# EAGLE design bloxa (EAGLE 9.6.2)
Assembly variants: Basic, nocaps
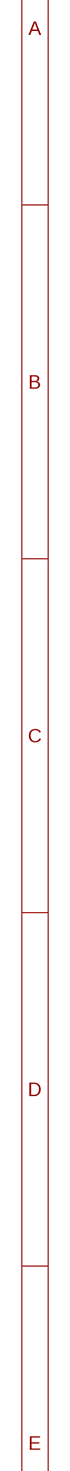
[diagram p0: schematic, sheet 1, part 1 of 2]
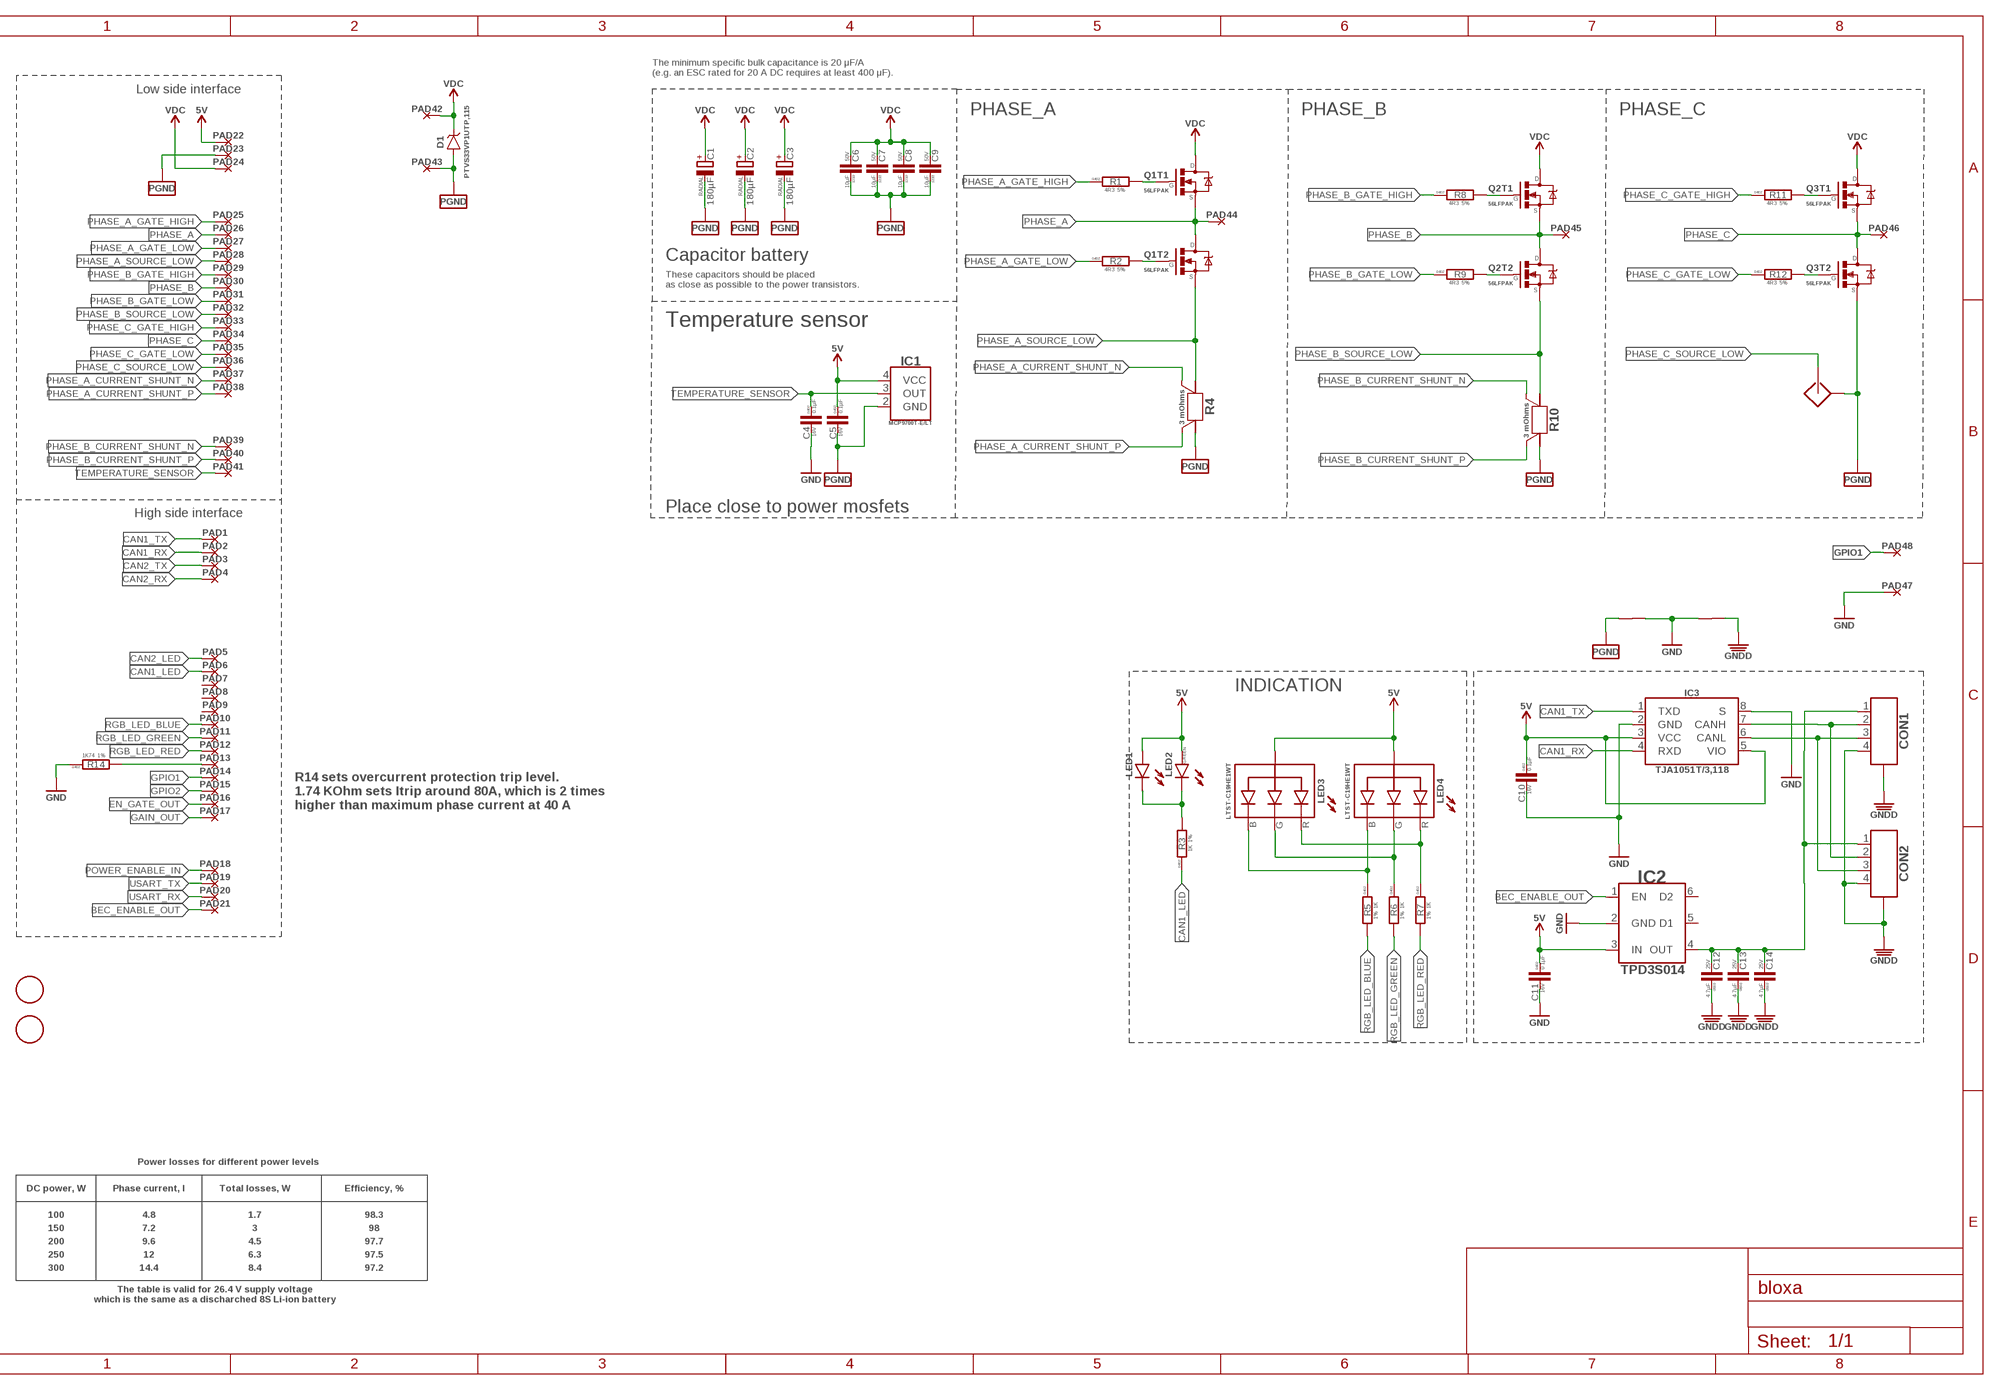
[diagram p1: schematic, sheet 1, part 2 of 2]

## Parts
C1  180µF  CPOL-RADIAL_SIDE-8X21.5  [RADIAL_SIDE_8X21.5]  (not fitted in variant nocaps)
C2  180µF  CPOL-RADIAL_SIDE-8X21.5  [RADIAL_SIDE_8X21.5]  (not fitted in variant nocaps)
C3  180µF  CPOL-RADIAL_SIDE-8X21.5  [RADIAL_SIDE_8X21.5]  (not fitted in variant nocaps)
C4  0.1µF  0.1µF-16V_10%_X7R-0402  [C0402]
C5  0.1µF  0.1µF-16V_10%_X7R-0402  [C0402]
C6  10µF  10µF-50_10%_X7S-C1210  [C1210]
C7  10µF  10µF-50_10%_X7S-C1210  [C1210]
C8  10µF  10µF-50_10%_X7S-C1210  [C1210]
C9  10µF  10µF-50_10%_X7S-C1210  [C1210]
C10  0.1µF  0.1µF-16V_10%_X7R-0402  [C0402]
C11  0.1µF  0.1µF-16V_10%_X7R-0402  [C0402]
C12  4.7µF  4.7µF-25V_10%_X6S-0603  [C0603]
C13  4.7µF  4.7µF-25V_10%_X6S-0603  [C0603]
C14  4.7µF  4.7µF-25V_10%_X6S-0603  [C0603]
CON1  CON-4P-JST_GH-RA  [JST_GH-4P-RA]
CON2  CON-4P-JST_GH-RA  [JST_GH-4P-RA]
D1  PTVS33VP1UTP,115-36V-SOD128  [SOD128]
FD1  FIDUCIALMOUNT  [FIDUCIA-MOUNT]  (not fitted in variant Basic)
FD2  FIDUCIALMOUNT  [FIDUCIA-MOUNT]  (not fitted in variant Basic)
IC1  MCP9700-SC70-5  [SC70-5]
IC2  TPD3S014DBVR-SOT23-6  [SOT26]
IC3  TJA1051(X)/3-SO8  [SOIC8]
J1  CONNECTION  [CONNECTION]  (not fitted in variant Basic)  (not fitted in variant nocaps)
J2  CONNECTION  [CONNECTION]  (not fitted in variant Basic)  (not fitted in variant nocaps)
LED1  GREEN  LED-0402  [LED0402]  (not fitted in variant Basic)
LED2  GREEN  LED-0402  [LED0402]
LED3  LTST-C19HE1WT  [0606]  (not fitted in variant Basic)
LED4  LTST-C19HE1WT  [0606]
PAD1  PAD-1X1.5  [SMD_1X1,5]  (not fitted in variant Basic)
PAD2  PAD-1X1.5  [SMD_1X1,5]  (not fitted in variant Basic)
PAD3  PAD-1X1.5  [SMD_1X1,5]  (not fitted in variant Basic)
PAD4  PAD-1X1.5  [SMD_1X1,5]  (not fitted in variant Basic)
PAD5  PAD-HOLE-0.6  [HOLE_0.6]  (not fitted in variant Basic)
PAD6  PAD-HOLE-0.6  [HOLE_0.6]  (not fitted in variant Basic)
PAD7  PAD-HOLE-0.6  [HOLE_0.6]  (not fitted in variant Basic)
PAD8  PAD-HOLE-0.6  [HOLE_0.6]  (not fitted in variant Basic)
PAD9  PAD-HOLE-0.6  [HOLE_0.6]  (not fitted in variant Basic)
PAD10  PAD-HOLE-0.6  [HOLE_0.6]  (not fitted in variant Basic)
PAD11  PAD-HOLE-0.6  [HOLE_0.6]  (not fitted in variant Basic)
PAD12  PAD-HOLE-0.6  [HOLE_0.6]  (not fitted in variant Basic)
PAD13  PAD-HOLE-0.6  [HOLE_0.6]  (not fitted in variant Basic)
PAD14  PAD-HOLE-0.6  [HOLE_0.6]  (not fitted in variant Basic)
PAD15  PAD-HOLE-0.6  [HOLE_0.6]  (not fitted in variant Basic)
PAD16  PAD-HOLE-0.6  [HOLE_0.6]  (not fitted in variant Basic)
PAD17  PAD-HOLE-0.6  [HOLE_0.6]  (not fitted in variant Basic)
PAD18  PAD-HOLE-0.6  [HOLE_0.6]  (not fitted in variant Basic)
PAD19  PAD-HOLE-0.6  [HOLE_0.6]  (not fitted in variant Basic)
PAD20  PAD-HOLE-0.6  [HOLE_0.6]  (not fitted in variant Basic)
PAD21  PAD-HOLE-0.6  [HOLE_0.6]  (not fitted in variant Basic)
PAD22  PAD-1X1.5  [SMD_1X1,5]  (not fitted in variant Basic)
PAD23  PAD-1X1.5  [SMD_1X1,5]  (not fitted in variant Basic)
PAD24  PAD-1X1.5  [SMD_1X1,5]  (not fitted in variant Basic)
PAD25  PAD-HOLE-0.6  [HOLE_0.6]  (not fitted in variant Basic)
PAD26  PAD-HOLE-0.6  [HOLE_0.6]  (not fitted in variant Basic)
PAD27  PAD-HOLE-0.6  [HOLE_0.6]  (not fitted in variant Basic)
PAD28  PAD-HOLE-0.6  [HOLE_0.6]  (not fitted in variant Basic)
PAD29  PAD-HOLE-0.6  [HOLE_0.6]  (not fitted in variant Basic)
PAD30  PAD-HOLE-0.6  [HOLE_0.6]  (not fitted in variant Basic)
PAD31  PAD-HOLE-0.6  [HOLE_0.6]  (not fitted in variant Basic)
PAD32  PAD-HOLE-0.6  [HOLE_0.6]  (not fitted in variant Basic)
PAD33  PAD-HOLE-0.6  [HOLE_0.6]  (not fitted in variant Basic)
PAD34  PAD-HOLE-0.6  [HOLE_0.6]  (not fitted in variant Basic)
PAD35  PAD-HOLE-0.6  [HOLE_0.6]  (not fitted in variant Basic)
PAD36  PAD-HOLE-0.6  [HOLE_0.6]  (not fitted in variant Basic)
PAD37  PAD-HOLE-0.6  [HOLE_0.6]  (not fitted in variant Basic)
PAD38  PAD-HOLE-0.6  [HOLE_0.6]  (not fitted in variant Basic)
PAD39  PAD-HOLE-0.6  [HOLE_0.6]  (not fitted in variant Basic)
PAD40  PAD-HOLE-0.6  [HOLE_0.6]  (not fitted in variant Basic)
PAD41  PAD-HOLE-0.6  [HOLE_0.6]  (not fitted in variant Basic)
PAD42  PAD-4X2  [4X2]  (not fitted in variant Basic)
PAD43  PAD-4X2  [4X2]  (not fitted in variant Basic)
PAD44  PAD-HOLE_1.5  [HOLE_1.5]  (not fitted in variant Basic)
PAD45  PAD-HOLE_1.5  [HOLE_1.5]  (not fitted in variant Basic)
PAD46  PAD-HOLE_1.5  [HOLE_1.5]  (not fitted in variant Basic)
PAD47  PAD-S-1.5  [1.5X1.5]
PAD48  PAD-S-1.5  [1.5X1.5]
Q1  BUK9K6R2-40E,115  [SOT-1205]
Q2  BUK9K6R2-40E,115  [SOT-1205]
Q3  BUK9K6R2-40E,115  [SOT-1205]
R1  4R3  4R3-5%-0402  [R0402]
R2  4R3  4R3-5%-0402  [R0402]
R3  1K  1K-1%-0402  [R0402]
R4  3 mOhms  CURRENT_SHUNT_KELVIN-0.010R-2512-KELVIN  [R2512-KELVIN]
R5  1K  1K-1%-0402  [R0402]
R6  1K  1K-1%-0402  [R0402]
R7  1K  1K-1%-0402  [R0402]
R8  4R3  4R3-5%-0402  [R0402]
R9  4R3  4R3-5%-0402  [R0402]
R10  3 mOhms  CURRENT_SHUNT_KELVIN-0.010R-2512-KELVIN  [R2512-KELVIN]
R11  4R3  4R3-5%-0402  [R0402]
R12  4R3  4R3-5%-0402  [R0402]
R14  1K74  R-1%-0402  [R0402]
S1  SENSE  [SENSE-0.6]  (not fitted in variant Basic)  (not fitted in variant nocaps)

## Nets
BEC_ENABLE_OUT: IC2.1(EN) PAD21.P$1
CAN1_LED: PAD6.P$1 R3.1
CAN1_RX: IC3.4(RXD) PAD2.P$1
CAN1_TX: IC3.1(TXD) PAD1.P$1
CAN1_VDD: C12.P$2 C13.P$2 C14.P$2 CON1.1 CON2.1 IC2.4(OUT)
CAN2_LED: PAD5.P$1
CAN2_RX: PAD4.P$1
CAN2_TX: PAD3.P$1
EN_GATE_OUT: PAD16.P$1
GAIN_OUT: PAD17.P$1
GND: C4.2 C10.2 C11.2 IC2.2(GND) IC3.2(GND) IC3.8(S) J1.P$1 J2.P$1 PAD47.P$1 R14.1
GNDD: C12.P$1 C13.P$1 C14.P$1 CON1.4 CON1.M$0(GND) CON1.M$1(GND) CON2.4 CON2.M$0(GND) CON2.M$1(GND) J2.P$2
GPIO1: PAD14.P$1 PAD48.P$1
GPIO2: PAD15.P$1
N$4: LED3.G LED4.G R6.1
N$17: LED1.C LED2.C R3.2
N$22: CON1.2 CON2.2 IC3.7(CANH)
N$23: CON1.3 CON2.3 IC3.6(CANL)
N$24 [HV]: Q1.2(T1:G) R1.2
N$27: Q1.4(T2:G) R2.2
N$28 [HV]: Q3.2(T1:G) R11.2
N$29: Q3.4(T2:G) R12.2
N$30: Q2.2(T1:G) R8.2
N$31: Q2.4(T2:G) R9.2
N$58: LED3.R LED4.R R7.1
N$60: LED3.B LED4.B R5.1
OVERCURRENT_PROTECT_ADJ: PAD13.P$1 R14.2
PGND: C1.- C2.- C3.- C5.2 C6.1 C7.1 C8.1 C9.1 D1.A IC1.2(GND) J1.P$2 PAD23.P$1 PAD43.P$1 Q3.3(T2:S) R4.2 R4.22 R10.2 R10.22 S1.SHELL(SHELLL)
PHASE_A [HV]: PAD26.P$1 PAD44.P$1 Q1.1(T1:S) Q1.5(T2:D) Q1.6(T2:D) Q1.EP-5-6(T2:D)
PHASE_A_CURRENT_SHUNT_N: PAD37.P$1 R4.S1
PHASE_A_CURRENT_SHUNT_P: PAD38.P$1 R4.S2
PHASE_A_GATE_HIGH [HV]: PAD25.P$1 R1.1
PHASE_A_GATE_LOW: PAD27.P$1 R2.1
PHASE_A_SOURCE_LOW: PAD28.P$1 Q1.3(T2:S) R4.1 R4.11
PHASE_B [HV]: PAD30.P$1 PAD45.P$1 Q2.1(T1:S) Q2.5(T2:D) Q2.6(T2:D) Q2.EP-5-6(T2:D)
PHASE_B_CURRENT_SHUNT_N: PAD39.P$1 R10.S1
PHASE_B_CURRENT_SHUNT_P: PAD40.P$1 R10.S2
PHASE_B_GATE_HIGH [HV]: PAD29.P$1 R8.1
PHASE_B_GATE_LOW: PAD31.P$1 R9.1
PHASE_B_SOURCE_LOW: PAD32.P$1 Q2.3(T2:S) R10.1 R10.11
PHASE_C [HV]: PAD34.P$1 PAD46.P$1 Q3.1(T1:S) Q3.5(T2:D) Q3.6(T2:D) Q3.EP-5-6(T2:D)
PHASE_C_GATE_HIGH [HV]: PAD33.P$1 R11.1
PHASE_C_GATE_LOW: PAD35.P$1 R12.1
PHASE_C_SOURCE_LOW: PAD36.P$1 S1.IN
POWER_ENABLE_IN: PAD18.P$1
RGB_LED_BLUE: PAD10.P$1 R5.2
RGB_LED_GREEN: PAD11.P$1 R6.2
RGB_LED_RED: PAD12.P$1 R7.2
TEMPERATURE_SENSOR: C4.1 IC1.3(OUT) PAD41.P$1
USART_RX: PAD20.P$1
USART_TX: PAD19.P$1
VDC [HV]: C1.+ C2.+ C3.+ C6.2 C7.2 C8.2 C9.2 D1.C PAD24.P$1 PAD42.P$1 Q1.7(T1:D) Q1.8(T1:D) Q1.EP-7-8(T1:D) Q2.7(T1:D) Q2.8(T1:D) Q2.EP-7-8(T1:D) Q3.7(T1:D) Q3.8(T1:D) Q3.EP-7-8(T1:D)
VDD_5V: C5.1 C10.1 C11.1 IC1.4(VCC) IC2.3(IN) IC3.3(VCC) IC3.5(VIO) LED1.A LED2.A LED3.+(A) LED4.+(A) PAD22.P$1 ; supply symbol labelled 5V
Unconnected: IC2.5(D1) IC2.6(D2) PAD7.P$1 PAD8.P$1 PAD9.P$1

## Notes on the sheet
- The minimum specific bulk capacitance is 20 μF/A 
  (e.g. an ESC rated for 20 A DC requires at least 400 μF).
- Low side interface
- PHASE_A | PHASE_B | PHASE_C
- Capacitor battery
- These capacitors should be placed 
  as close as possible to the power transistors.
- Temperature sensor
- High side interface | Place close to power mosfets
- INDICATION
- R14 sets overcurrent protection trip level. 
  1.74 KOhm sets Itrip around 80A, which is 2 times 
  higher than maximum phase current at 40 A
- Power losses for different power levels
- DC power, W | Phase current, I | Total losses, W | Efficiency, %
- 100 | 4.8 | 1.7 | 98.3
- 150 | 7.2 | 3 | 98
- 200 | 9.6 | 4.5 | 97.7
- 250 | 12 | 6.3 | 97.5
- 300 | 14.4 | 8.4 | 97.2
- The table is valid for 26.4 V supply voltage
  which is the same as a discharched 8S Li-ion battery

## Library data of the parts
C1-C3 = rc:CPOL: Polar tantalum capacitor; DIGIKEY#: 565-4066-ND; MANF: United Chemi-Con; MANF#: EKZN500ELL181MH20D; PACKAGE: RADIAL; VOLTAGE: 50V
C4 C5 C10 C11 = C_digikey:0.1µF; DIGIKEY#: 490-3261-1-ND; MANF: Murata Electronics North America; MANF#: GRM155R71C104KA88D; OPERATING_TEMP: -55°C ~ 125°C; PACKAGE: 0402; TC: X7R; TOLERANCE: +-10%; VOLTAGE: 16V
C6-C9 = C_digikey:10µF; DIGIKEY#: 445-7004-1-ND; MANF: TDK Corporation; MANF#: CGA6P3X7S1H106K250AB; PACKAGE: 1210; TC: X7S; TOLERANCE: ±10%; VOLTAGE: 50V
C12-C14 = C_digikey:4.7µF; DIGIKEY#: 490-7199-1-ND; MANF: Murata Electronics North America; MANF#: GRM188C81E475KE11D; OPERATING_TEMP: -55°C ~ 105°C; PACKAGE: 0603; TC: X6S; TOLERANCE: +-10%; VOLTAGE: 25V
CON1 CON2 = Connectors:CON-4P: Connector Receptacle 4 Position 0.049" (1.25mm) Tin Surface Mount; DIGIKEY#: 455-1566-1-ND; MANF: JST Sales America Inc; MANF#: SM04B-GHS-TB(LF)(SN)
D1 = TVS_diodes:PTVS33VP1UTP,115: 53.3V Clamp 11.3A Ipp Tvs Diode Surface Mount CFP5; DIGIKEY#: 1727-1411-1-ND; MANF: Nexperia USA Inc; MANF#: PTVS33VP1UTP,115
FD1 FD2 = misc:FIDUCIALMOUNT; BOM: EXCLUDE
IC1 = misc:MCP9700: Temperature Sensor Analog, Local -40°C ~ 125°C 10mV/°C; DIGIKEY#: MCP9700T-E/LTCT-ND; MANF: Microchip Technology; MANF#: MCP9700T-E/LT
IC2 = myxa_masterlib:TPD3S014DBVR; DIGIKEY#: 296-38835-1-ND; MANF: Texas Instruments; MANF#: TPD3S014DBVR
IC3 = serial_interfaces:TJA1051(X)/3: 1/1 Transceiver Half CAN 8-HVSON (3x3); DIGIKEY#: 568-8684-2-ND; MANF: NXP USA Inc; MANF#: TJA1051T/3,118
J1 J2 = misc:CONNECTION; BOM: EXCLUDE
LED1 = rc:LED: SMD LED
LED2 = rc:LED: SMD LED; COLOR: GREEN; DIGIKEY#: 1830-IN-S42BT5GCT-ND; MANF: Inolux; MANF#: IN-S42BT5G
LED3 LED4 = misc:LTST-C19HE1WT: LED RGB DIFFUSED CHIP SMD; DIGIKEY#: 160-2162-1-ND; MANF: Lite-On Inc; MANF#: LTST-C19HE1WT
PAD1-PAD41 PAD47 PAD48 = PADS:PAD
PAD42-PAD46 = PADS:PAD; BOM: EXCLUDE
Q1-Q3 = mosfet:BUK9K6R2-40E,115: Mosfet Array 2 N-Channel (Dual) 40V 40A 68W Surface Mount LFPAK56D; DIGIKEY#: 1727-7274-1-ND; MANF: NXP Semiconductors; MANF#: BUK9K6R2-40E,115; PACKAGE: 56LFPAK
R1 R2 R8 R9 R11 R12 = R_digikey:4R3; DIGIKEY#: 311-4.3JRCT-ND; MANF: Yageo; MANF#: RC0402JR-074R3L; PACKAGE: 0402; TOLERANCE: 5%
R3 R5-R7 = R_digikey:1K; DIGIKEY#: 311-1.00KLRCT-ND; MANF: Yageo; MANF#: RC0402FR-071KL; PACKAGE: 0402; TOLERANCE: 1%
R4 R10 = SHUNT_RESISTORS:CURRENT_SHUNT_KELVIN; DIGIKEY#: 2019-TLR3APSDTE3L00F50CT-ND; MANF: KOA Speer Electronics, Inc.; MANF#: TLR3APSDTE3L00F50; PACKAGE: 2512; POWER: 5W; TC: ±50ppm/°C; TOLERANCE: ±1%; VALUE: 10 mOhms
R14 = rc:R; AEC-Q: AEC-Q200; DIGIKEY#: 541-1.74KLCT-ND; MANF: Vishay Dale; MANF#: CRCW04021K74FKED; PACKAGE: 0402; TOLERANCE: 1%
S1 = misc:SENSE; BOM: EXCLUDE

## Net classes
1 HV: clearance 0.25 mm to class 0, clearance 0.25 mm

## Board
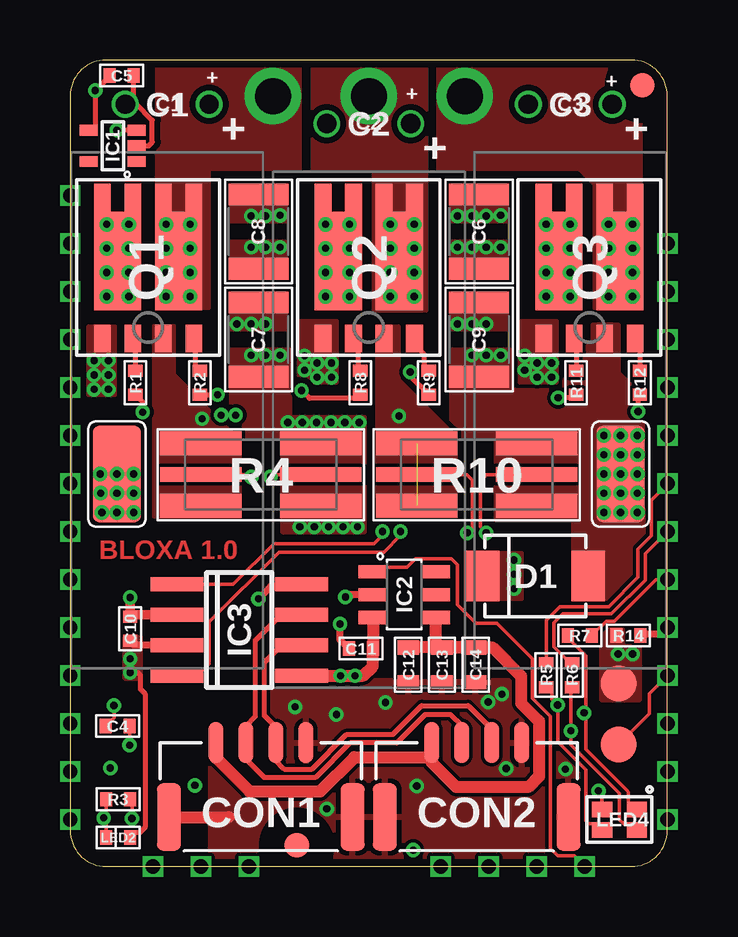
[diagram p2: board, top side]
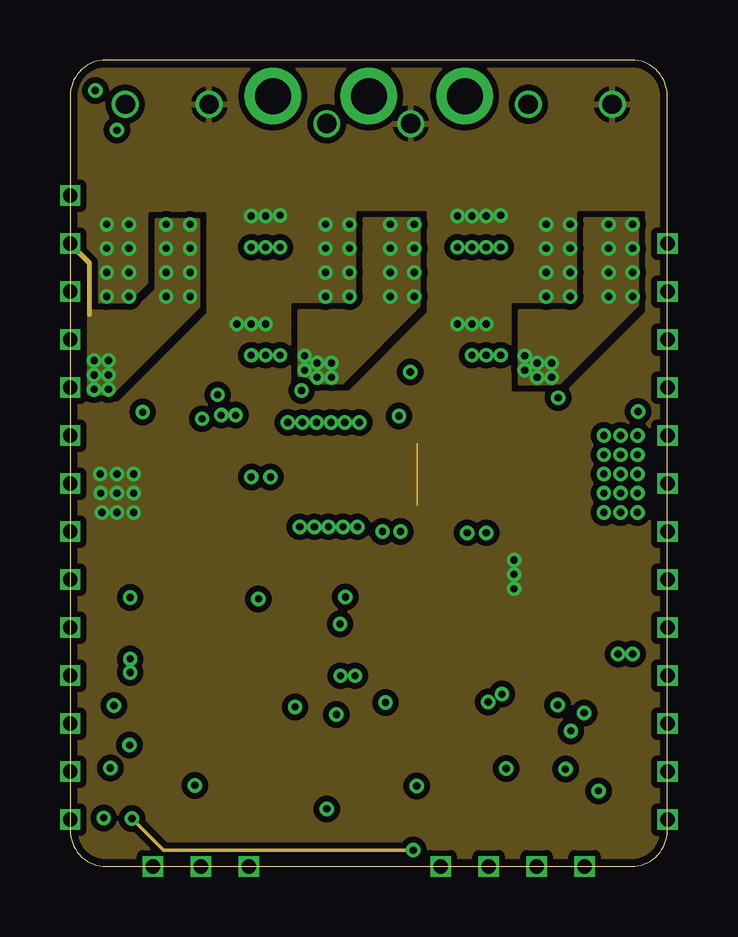
[diagram p3: board, inner layer pwr]
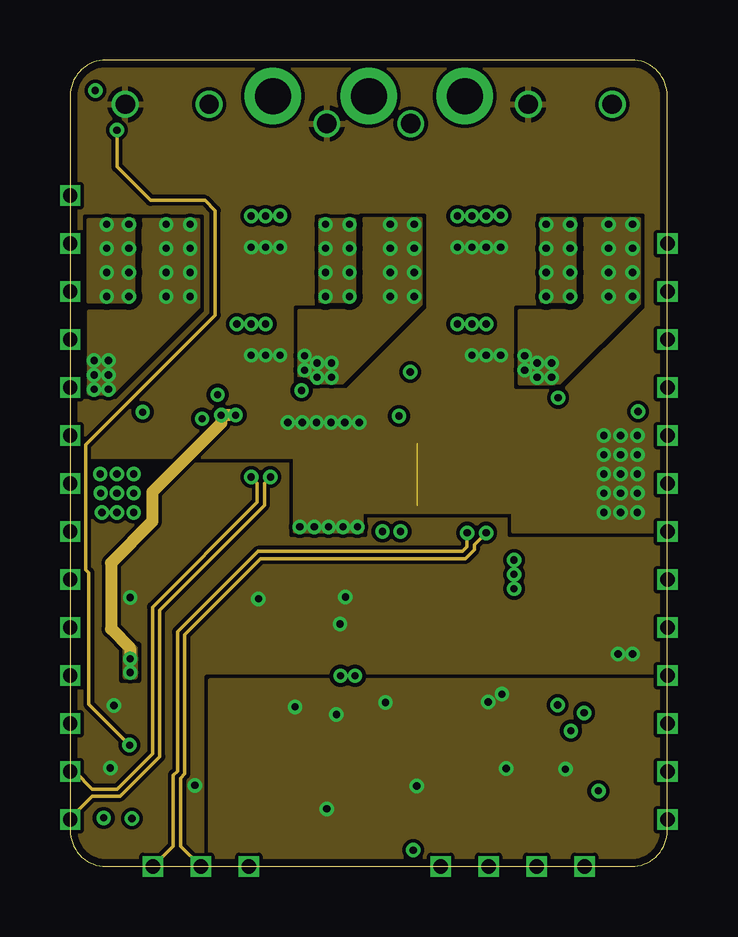
[diagram p4: board, inner layer gnd]
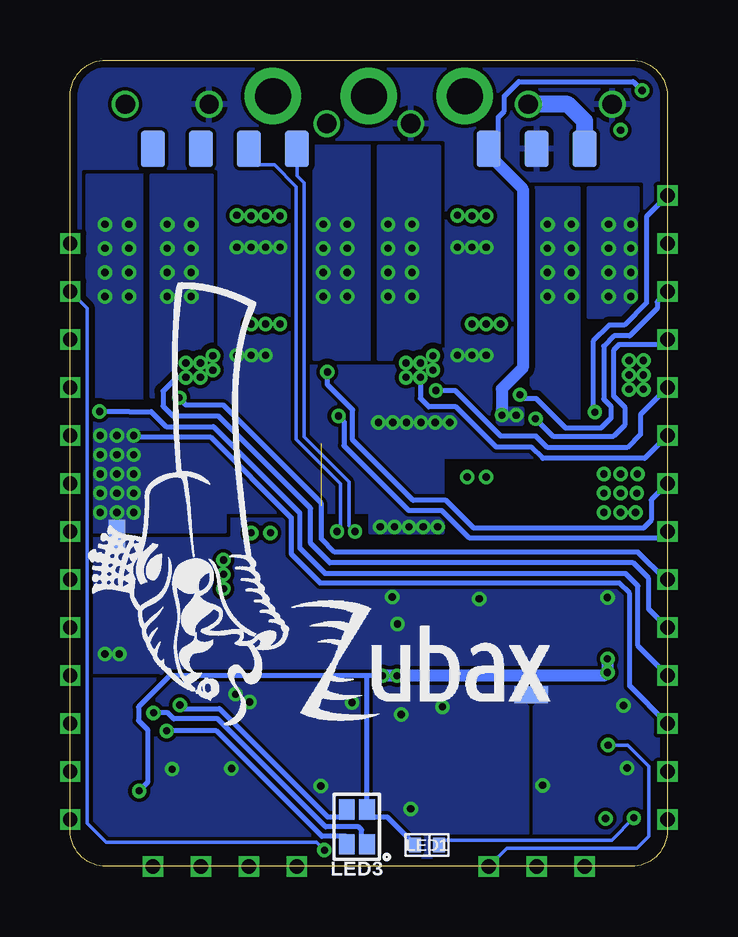
[diagram p5: board, bottom side, seen from below]

Size 24.9 x 33.6 mm. Coordinates in mm from the lower left corner, seen from the top.
Outline: 1.5,0 23.4,0 arc90 24.9,1.5 24.9,32.1 arc90 23.4,33.6 1.5,33.6 arc90 0,32.1 0,1.5 arc90 1.5,0
Copper layers (1+2*15+16): Top 0.035mm / dielectric 0.12mm / pwr 0.035mm / dielectric 1.2mm / gnd 0.035mm / dielectric 0.12mm / Bottom 0.035mm
Design rules "design_rules *": minimum track width 0.15mm, minimum drill 0.2mm, track to track 0.15mm, track to pad 0.15mm, pad to pad 0.15mm, via to via 0.15mm, smd to smd 0.15mm, copper to edge 0.3mm, drill to drill 0.2mm, minimum pad ring 0.125mm, minimum via ring 0.125mm, stop-mask expansion 1mil, vias tented up to drill 0.31mm, thermal gap 8mil

### Footprints (pad centres in the part's own frame; a part is rotated, then mirrored left to right if it is on the bottom)
RADIAL_SIDE_8X21.5 = drill 0.8: + -1.75,0; - 1.75,0
C0402 = smd 0.5 x 0.6: 1 -0.5,0; 2 0.5,0
C1210 = smd 0.9 x 2.5: 1 -1.55,0; 2 1.55,0
C0603 = smd 0.6 x 0.9: P$1 -0.725,0; P$2 0.725,0
JST_GH-4P-RA = smd 0.6 x 1.7: 1 1.875,-2.91; 2 0.625,-2.91; 3 -0.625,-2.91; 4 -1.875,-2.91 | smd 1 x 2.8: M$0 -3.825,0.19; M$1 3.825,0.19
SOD128 = smd 1.4 x 2.1: A -2.2,0; C 2.2,0
FIDUCIA-MOUNT = smd 1.016 x 1.016: P$1 0,0
SC70-5 = smd 0.75 x 0.45: 1 -1,0.65; 2 -1,0; 3 -1,-0.65; 4 1,-0.65; 5 1,0.65
SOT26 = smd 1.2 x 0.55: 1 -1.3,0.95; 2 -1.3,0; 3 -1.3,-0.95; 4 1.3,-0.95; 5 1.3,0; 6 1.3,0.95
SOIC8 = smd 2.2 x 0.6: 1 -2.6,1.905; 2 -2.6,0.635; 3 -2.6,-0.635; 4 -2.6,-1.905; 5 2.6,-1.905; 6 2.6,-0.635; 7 2.6,0.635; 8 2.6,1.905
CONNECTION = smd 0.7 x 0.7: P$1 -0.35,0; P$2 0.35,0
LED0402 = smd 0.5 x 0.6: A -0.5,0; C 0.5,0
0606 = smd 0.65 x 0.85: + -0.425,-0.725; B 0.425,-0.725; G 0.425,0.725; R -0.425,0.725
SMD_1X1,5 = smd 1 x 1.5: P$1 0,0
HOLE_0.6 = drill 0.6 square: P$1 0,0
4X2 = smd 4 x 2: P$1 0,0
HOLE_1.5 = drill 1.5 pad 2.35: P$1 0,0
1.5X1.5 = smd 1.5 x 1.5: P$1 0,0
SOT-1205 = smd 1.15 x 0.7: 1 -2.95,1.905; 2 -2.95,0.635; 3 -2.95,-0.635; 4 -2.95,-1.905 | smd 1.9 x 0.7: 5 2.553,-1.905; 6 2.553,-0.635; 7 2.553,0.635; 8 2.553,1.905 | smd 4.1 x 1.97: EP-5-6 0.27,-1.27; EP-7-8 0.27,1.27
R0402 = smd 0.5 x 0.6: 1 -0.5,0; 2 0.5,0
R2512-KELVIN = smd 3.4 x 1: 1 -2.5,1.3; 2 2.5,1.3; 11 -2.5,-1.3; 22 2.5,-1.3 | smd 3.4 x 0.6: S1 -2.5,0; S2 2.5,0
SENSE-0.6 = smd 0.1 x 0.1: IN 0,0 | drill 0.3 pad 0.6: SHELL 0,0

### Placement (x,y rotation side)
C1  4.05,31.75 180 top
C2  12.45,30.95 180 top
C3  20.85,31.75 180 top
C4  1.97,5.85 180 top
C5  2.15,32.95 0 top
C6  17.05,26.45 90 top
C7  7.85,21.95 90 top
C8  7.85,26.45 90 top
C9  17.05,21.95 90 top
C10  2.5,9.9 90 top
C11  12.12,9.07 180 top
C12  14.1,8.4 90 top
C13  15.5,8.4 90 top
C14  16.9,8.4 90 top
CON1  7.95,2.25 180 top
CON2  16.95,2.25 180 top
D1  19.4,12.1 180 top
FD1  23.85,32.55 0 top
FD2  9.45,0.88 0 top
IC1  1.77,30.02 180 top
IC2  13.92,11.32 0 top
IC3  7.05,9.85 0 top
J1  22.95,13.75 90 bottom
J2  5.67,7.15 180 bottom
LED1  10.02,0.9 0 bottom
LED2  2,1.2 180 top
LED3  12.95,1.65 180 bottom
LED4  22.9,1.95 270 top
PAD1  15.45,29.9 0 bottom
PAD2  17.45,29.9 0 bottom
PAD3  19.45,29.9 0 bottom
PAD4  21.45,29.9 0 bottom
PAD5  24.9,25.95 0 bottom
PAD6  24.9,23.95 0 bottom
PAD7  24.9,21.95 0 bottom
PAD8  24.9,19.95 0 bottom
PAD9  24.9,17.95 0 bottom
PAD10  24.9,15.95 0 bottom
PAD11  24.9,13.95 0 bottom
PAD12  24.9,11.95 0 bottom
PAD13  24.9,9.95 0 bottom
PAD14  24.9,7.95 0 bottom
PAD15  24.9,5.95 0 bottom
PAD16  24.9,3.95 0 bottom
PAD17  24.9,1.95 0 bottom
PAD18  15.45,0 0 bottom
PAD19  17.45,0 0 bottom
PAD20  19.45,0 0 bottom
PAD21  21.45,0 0 bottom
PAD22  7.45,29.9 0 bottom
PAD23  5.45,29.9 0 bottom
PAD24  3.45,29.9 0 bottom
PAD25  0,27.95 0 bottom
PAD26  0,25.95 0 bottom
PAD27  0,23.95 0 bottom
PAD28  0,21.95 0 bottom
PAD29  0,19.95 0 bottom
PAD30  0,17.95 0 bottom
PAD31  0,15.95 0 bottom
PAD32  0,13.95 0 bottom
PAD33  0,11.95 0 bottom
PAD34  0,9.95 0 bottom
PAD35  0,7.95 0 bottom
PAD36  0,5.95 0 bottom
PAD37  0,3.95 0 bottom
PAD38  0,1.95 0 bottom
PAD39  3.45,0 0 bottom
PAD40  5.45,0 0 bottom
PAD41  7.45,0 0 bottom
PAD42  1.95,16.35 90 top
PAD43  22.95,16.35 90 top
PAD44  8.45,32.1 0 top
PAD45  12.45,32.1 270 top
PAD46  16.45,32.1 0 top
PAD47  22.88,7.62 0 top
PAD48  22.88,5.08 0 top
Q1  3.25,24.95 90 top
Q2  12.45,24.95 90 top
Q3  21.65,24.95 90 top
R1  2.72,20.15 90 top
R2  5.4,20.15 90 top
R3  2,2.8 180 top
R4  7.95,16.32 0 top
R5  19.85,7.97 90 top
R6  20.92,7.97 90 top
R7  21.25,9.62 0 top
R8  12.1,20.15 90 top
R9  14.95,20.15 90 top
R10  16.95,16.32 0 top
R11  21.1,20.15 90 top
R12  23.75,20.15 90 top
R14  23.27,9.62 0 top
S1  22.25,17.95 0 bottom
U$2  [DRAGON-18X7]  15.75,5.88 90 bottom
U$13  [ZUBAX_LOGO_5X10]  15.75,5.88 0 bottom

### Tracks (layer width: path | path; a pad name or v marks a point on that pad's centre or on a via)
BEC_ENABLE_OUT
  Top 0.15: PAD21.P$1 21.02,0.43 20.33,0.43 20.02,0.74 20.02,6.25 19.27,7 19.27,8.65 17.8,10.12 16.92,10.12 16.15,10.9 16.15,12.57 15.9,12.82 14.4,12.82 14.05,12.47 12.82,12.47 IC2.1
CAN1_LED  (via drill 0.3 pad 0.6)
  Top 0.15: R3.1 2.57,2.72 v2.57,1.99
  pwr 0.15: v2.57,1.99 3.89,0.67 v14.3,0.67
  Bottom 0.15: 24.2,23.15 24.2,1.8 23.4,1 14.62,1 v14.3,0.67 | 24.2,23.15 24.2,23.25 | PAD6.P$1 24.2,23.25 | 24.2,23.25 24.2,23.15
CAN1_RX  (via drill 0.3 pad 0.6)
  Top 0.15: IC3.4 5.29,7.94 5.8,8.45 5.8,10.2 8.7,13.1 13.07,13.1 13.77,13.8 v13.77,13.95
  Bottom 0.15: PAD2.P$1 17.42,29.9 17.42,29.62 17.02,29.23 16.38,29.23 15.47,28.32 15.47,17.8 13.62,15.95 13.62,14.1 v13.77,13.95
CAN1_TX  (via drill 0.3 pad 0.6)
  Top 0.15: IC3.1 4.8,11.75 6.8,11.75 8.5,13.45 12.67,13.45 13.02,13.8 v13.02,13.95
  Bottom 0.15: PAD1.P$1 15.45,28.77 15.15,28.48 15.15,17.9 13.27,16.02 13.27,14.2 v13.02,13.95
CAN1_VDD
  Top 0.5: CON1.1 6.07,4.52 7.47,3.12 10.42,3.12 11.85,4.55 14.97,4.55 15.07,4.65 | CON2.1 15.07,4.65 | C14.P$2 C13.P$2 C12.P$2 | IC2.4 15.22,9.12 C14.P$2 | C14.P$2 17.6,9.12 18.8,7.92 18.8,6.8 19.55,6.05 19.55,3.75 19.1,3.3 16.1,3.3 15.07,4.32 15.07,4.65
GND  (via drill 0.3 pad 0.6)
  Top 0.15: C4.2 1.82,6.2 v1.82,6.7
  Top 0.3: v11.25,10.1 11.25,9.45 C11.2 | IC2.2 11.57,11.32 v11.47,11.22 | IC3.8 9.55,11.65 8.36,11.65 v7.85,11.15
  Top 0.4: IC3.2 2.58,10.48 C10.2 v2.5,11.2
  other vias: 1.67,4.1 5.2,3.38 22.85,8.85 23.45,8.85
  pour gnd (rank 4): 0,16.9 24.9,16.9 24.9,0.85 24.9,0 11.7,0 0,0
  pour Bottom (rank 4): 0,16.9 24.9,16.9 24.9,0 0,0
  pour Top (no thermals): 23.75,9.15 23.05,9.15 23.05,9.85 22.15,9.85 22.15,6.95 23.75,6.95
GNDD  (via drill 0.3 pad 0.6)
  Top 0.5: CON1.M$1 6.62,2.05
  other vias: 14.45,3.35 20.65,4.05 17.42,6.85 13.15,6.82 11.1,6.32 10.7,2.4 18,7.17 18.17,4.07 9.38,6.65
  pour Top (rank 2): 5.85,7.75 24.9,7.75 24.9,0 5.85,0
  pour Bottom: 5.85,7.75 24.9,7.75 24.9,0 5.85,0
  pour gnd (rank 2): 5.85,7.75 24.9,7.75 24.9,0 5.85,0
GPIO1
  Top 0.15: PAD14.P$1 24.15,7.2 24.15,6.35 PAD48.P$1
N$4  (via drill 0.3 pad 0.6)
  Top 0.15: LED4.G 23.38,1.77 23.07,1.77 22.9,1.95 22.9,3.05 20.88,5.07 v20.88,5.65 20.88,7.42 R6.1
  Bottom 0.2: LED3.G 13.38,1.25 14.4,1.25 18.8,5.65 v20.88,5.65
N$17  (via drill 0.3 pad 0.6)
  Top 0.15: LED2.C 1.5,1.97 | 1.5,1.97 1.45,2.02 v1.4,2.02 | R3.2 1.5,1.97
  Bottom 0.15: v1.4,2.02 2.32,1.1 9.32,1.1 LED1.C
N$22
  Top 0.2: CON2.2 16.32,5.88 15.88,6.32 14.8,6.32 13.62,5.15 11.67,5.15 10.22,3.7 8.1,3.7 7.32,4.47 CON1.2 7.32,5.67 7.32,5.85 7.72,6.25 7.72,9.42 8.79,10.48 IC3.7
N$23
  Top 0.2: CON2.3 17.57,5.72 16.6,6.7 14.65,6.7 13.45,5.5 11.52,5.5 10.07,4.05 8.92,4.05 8.57,4.4 CON1.3 8.57,5.8 8.1,6.27 8.1,8.5 8.81,9.21 IC3.6
N$24
  Top 0.2: R1.2 2.72,21.89 Q1.2
N$27
  Top 0.2: Q1.4 5.2,21.95 5.2,20.82 5.37,20.65 R2.2
N$28
  Top 0.2: Q3.2 21.1,21.91 R11.2
N$29
  Top 0.2: Q3.4 23.75,21.8 R12.2
N$30
  Top 0.2: Q2.2 12,21.81 12,20.75 R8.2
N$31
  Top 0.2: Q2.4 14.35,21.74 14.75,21.35 14.75,20.85 R9.2
N$58  (via drill 0.3 pad 0.6)
  Top 0.15: LED4.R 23.52,2.38 23.27,2.62 23.27,2.92 23.27,3.1 23.22,3.15 21.5,4.87 21.5,6.32 v21.42,6.4 21.5,6.47 21.5,8.77 20.75,9.52 R7.1
  Bottom 0.2: LED3.R 12.75,1.15 12.75,1.52 12.88,1.65 14.24,1.65 18.74,6.15 20.58,6.15 20.83,6.4 v21.42,6.4
N$60  (via drill 0.3 pad 0.6)
  Top 0.15: LED4.B 22.15,1.52 21.9,1.77 21.62,1.77 21.5,1.9 21.5,4.03 20.32,5.2 v20.32,6.72 20.07,6.97 20.07,7.47 R5.1
  Bottom 0.2: LED3.B 13.38,2.07 13.4,2.05 14.15,2.05 18.67,6.57 20.17,6.57 v20.32,6.72
OVERCURRENT_PROTECT_ADJ
  Top 0.3: PAD13.P$1 24.9,9.75 24.82,9.67 23.82,9.67 R14.2
PGND  (via drill 0.3 pad 0.6)
  Top 0.2: IC1.2 3.27,30.02 3.42,30.17 3.42,31.1 2.77,31.75 C1.- 2.65,31.75 C5.2
  other vias: 7.55,25.8 8.15,25.8 8.75,25.8 7.55,21.3 8.15,21.3 8.75,21.3 16.75,25.8 17.35,25.8 16.15,25.8 17.95,25.8 16.75,21.3 17.35,21.3 17.95,21.3 9.67,18.5 10.27,18.5 10.88,18.5 11.45,18.5 12.05,18.5 9.57,14.15 10.17,14.15 10.77,14.15 11.38,14.15 9.07,18.5 11.97,14.15 22.95,16.35 23.65,16.35 23.65,17.15 23.65,17.95 22.95,17.15 22.95,17.95 23.65,14.75 23.65,15.55 22.95,14.75 22.95,15.55 22.25,16.35 22.25,17.15 22.25,15.55 22.25,14.75
  pour gnd (rank 3): 0,33.6 0,17.05 9.35,17.05 9.35,13.95 12.17,13.95 12.17,14.75 18.45,14.75 18.45,13.95 24.9,13.95 24.9,33.6
  pour Top (no thermals): 9,24.55 9,26 6.7,26 6.7,24.55
  pour Top (rank 2, no thermals): 9.17,17.93 9.17,21.5 6.7,21.5 6.7,17.93
  pour Top (no thermals): 18.2,24.55 18.2,26 15.9,26 15.9,24.55
  pour Top (rank 2, no thermals): 19.7,17.93 19.7,21.5 15.9,21.5 15.9,17.93
  pour Top (no thermals): 12.27,13.95 12.27,18.7 8.85,18.7 8.85,13.95
  pour Top (rank 2, no thermals): 23.88,14.45 23.88,19.55 22.85,20.55 22.85,22.55 21.8,22.55 21.8,21.85 18.67,18.7 17.75,18.7 17.75,14.45
  pour Top (rank 2, no thermals): 23.88,11.12 21,11.12 21,14.92 23.88,14.92
  pour Bottom (rank 3): 0,33.6 0,17.05 9.35,17.05 9.35,13.9 12.4,13.9 12.4,14.75 18.45,14.75 18.45,13.95 24.9,13.95 24.9,33.6
PHASE_A  (via drill 0.3 pad 0.6)
  pwr 0.2: 0.8,22.99 0.8,25.15 PAD26.P$1
  other vias: 1.6,21.08 1,21.08 1.6,20.48 1,20.48 1,19.88 1.6,19.88 5,24.75 4,24.75 4,25.75 5,25.75 5,23.75 4,23.75 4,26.75 5,26.75
  pour Top (no thermals): 9.57,33.3 9.57,29.05 5.8,29.05 5.8,23.25 3.6,23.25 3.6,33.3
  pour Top (no thermals): 1.88,22.5 0.75,22.5 0.75,19.62 1.88,19.62
  pour pwr: 0.77,23.12 0.77,19.7 1.72,19.7 5.35,23.32 5.35,26.95 3.57,26.95 3.57,24.02 2.67,23.12
  pour gnd: 0.77,23.12 0.77,19.7 1.75,19.7 5.35,23.3 5.35,26.95 3.05,26.95 3.05,23.5 2.67,23.12
  pour Bottom (rank 2): 5.67,18.45 3.7,18.45 3.7,28.27 5.67,28.27
PHASE_A_CURRENT_SHUNT_N  (via drill 0.3 pad 0.6)
  Top 0.15: R4.S1 7.45,16.32 v7.55,16.22
  gnd 0.15: PAD37.P$1 0.2,3.95 0.92,3.22 1.96,3.22 3.43,4.69 3.43,10.81 7.8,15.17 7.8,15.97 v7.55,16.22
PHASE_A_CURRENT_SHUNT_P  (via drill 0.3 pad 0.6)
  Top 0.15: R4.S2 8.45,16.32 v8.35,16.22
  gnd 0.15: PAD38.P$1 0,2 0.92,2.92 2.09,2.92 3.73,4.57 3.73,10.68 8.1,15.05 8.1,15.97 v8.35,16.22
PHASE_A_GATE_HIGH  (via drill 0.3 pad 0.6)
  Top 0.2: R1.1 3.02,19.35 v3.02,18.93
  Bottom 0.2: PAD25.P$1 0.88,27.07 0.88,23.48 1.8,22.55 2.42,22.55 3.1,21.88 3.1,19 v3.02,18.93
PHASE_A_GATE_LOW  (via drill 0.3 pad 0.6)
  Top 0.2: R2.1 v6.15,19.65
  Bottom 0.2: PAD27.P$1 0.42,23.52 0.42,23.25 1.57,22.1 2.22,22.1 2.65,21.67 2.65,19.47 2.35,19.17 2.35,18.68 2.76,18.27 4.25,18.27 5.47,19.5 6,19.5 v6.15,19.65
PHASE_A_SOURCE_LOW  (via drill 0.3 pad 0.6)
  Bottom 0.2: PAD28.P$1 0.2,21.75 2,21.75 2.25,21.5 2.25,19.61 1.77,19.13 1.77,18.39 2.24,17.93 4.77,17.93 v5.5,18.65
  pour Top (no thermals): 7.07,14.57 3.47,14.57 3.47,22.52 4.32,22.52 4.32,20.5 6.77,18.05 7.07,18.05
PHASE_B  (via drill 0.3 pad 0.6)
  Bottom 0.2: v10.3,20.38 10.3,19.5 9.95,19.15 8.81,19.15 7.2,17.55 7.13,17.47 5.67,17.47 5.2,17 0.95,17 PAD30.P$1
  other vias: 9.77,21.28 9.77,20.68 10.9,20.98 10.3,20.98 10.9,20.38 14.35,24.75 13.35,24.75 13.35,25.75 14.35,25.75 14.35,23.75 13.35,23.75 13.35,26.75 14.35,26.75
  pour Top (no thermals): 14.85,23.15 12.65,23.15 12.65,29.05 10.1,29.05 10.1,33.3 14.85,33.3
  pour Top (no thermals): 11.12,22.73 9.52,22.73 9.52,20.15 11.12,20.15
  pour pwr: 9.55,23.15 11.9,23.15 12.25,23.5 12.25,26.98 14.55,26.98 14.55,23.35 11.35,20.15 9.55,20.15
  pour gnd: 9.55,23.15 11.9,23.15 12.25,23.5 12.25,26.98 14.62,26.98 14.62,23.42 11.35,20.15 9.55,20.15
  pour Bottom (rank 2): 14.72,21.12 12.38,21.12 12.38,30 14.72,30
PHASE_B_CURRENT_SHUNT_N  (via drill 0.3 pad 0.6)
  Top 0.15: v16.55,13.9 16.77,14.12 16.77,16.1 16.55,16.32 R10.S1
  gnd 0.15: PAD39.P$1 4.3,0.85 4.3,3.8 4.47,3.97 4.47,9.77 7.82,13.12 16.35,13.12 16.55,13.32 v16.55,13.9
PHASE_B_CURRENT_SHUNT_P  (via drill 0.3 pad 0.6)
  Top 0.15: v17.35,13.9 17.1,14.15 17.1,16.07 17.35,16.32 R10.S2
  gnd 0.15: v17.35,13.9 16.85,13.4 16.85,13.2 16.48,12.82 7.95,12.82 4.77,9.65 4.77,3.85 4.6,3.68 4.6,0.85 PAD40.P$1
PHASE_B_GATE_HIGH  (via drill 0.3 pad 0.6)
  Top 0.15: R8.1 12.07,19.62 12.05,19.62 11.92,19.5
  Top 0.2: 11.92,19.5 9.97,19.5 v9.65,19.82
  Bottom 0.2: PAD29.P$1 1.12,18.82 1.12,18 1.67,17.45 5,17.45 5.47,17.93 6.94,17.93 6.96,17.94 8.84,19.82 v9.65,19.82
PHASE_B_GATE_LOW  (via drill 0.3 pad 0.6)
  Top 0.2: R9.1 14.17,20.42 v14.17,20.6
  Bottom 0.2: PAD31.P$1 0.67,15.27 0.67,14.42 1,14.1 8.07,14.1 9.22,15.25 10.6,15.25 13.12,17.77 13.12,19.02 14.17,20.07 v14.17,20.6
PHASE_B_SOURCE_LOW  (via drill 0.3 pad 0.6)  (1 unrouted)
  Bottom 0.2: v13.71,18.77 13.48,18.54 13.48,17.53 10.77,14.82 9.4,14.82 8.27,13.7 0.25,13.7 PAD32.P$1
  pour Top (no thermals): 13.7,22.5 12.8,22.5 12.8,15.42 16.07,15.42 16.07,17.93 13.7,20.3
PHASE_C  (via drill 0.3 pad 0.6)
  Bottom 0.2: v20.07,20.38 20.45,20.38 21.02,19.8 21.02,19.17 20.62,18.77 18.73,18.77 14.88,14.92 14.88,13.46 14.07,12.65 1.42,12.65 0.77,12 0.77,10.72 PAD34.P$1
  other vias: 18.95,21.28 18.95,20.68 20.07,20.98 19.47,20.98 19.47,20.38 23.45,24.75 22.45,24.75 22.45,25.75 23.45,25.75 23.45,23.75 22.45,23.75 22.45,26.75 23.45,26.75
  pour Top (no thermals): 15.32,33.3 15.32,29.05 21.2,29.05 21.85,28.4 21.85,23.25 23.8,23.25 23.8,33.3
  pour Top (no thermals): 20.3,22.73 18.73,22.73 18.73,20.15 20.3,20.15
  pour pwr: 18.73,23.15 21.1,23.15 21.45,23.5 21.45,26.98 23.65,26.98 23.65,23.38 20.38,20.1 18.73,20.1
  pour gnd: 18.73,23.15 21.1,23.15 21.45,23.5 21.45,26.98 23.73,26.98 23.73,23.45 20.38,20.1 18.73,20.1
  pour Bottom (rank 2): 24.2,19.52 21.85,19.52 21.85,28.8 24.2,28.8
PHASE_C_GATE_HIGH  (via drill 0.3 pad 0.6)
  Top 0.2: R11.1 20.98,19.53 v20.35,19.53
  Bottom 0.15: PAD33.P$1 0.07,11.95
  Bottom 0.152: v20.35,19.53 20.35,19.5
  Bottom 0.2: 0.07,11.95 1.22,13.1 13.88,13.1 14.42,13.65 14.42,15.12 18.53,19.23 20.08,19.23 20.35,19.5
PHASE_C_GATE_LOW  (via drill 0.3 pad 0.6)
  Top 0.2: R12.1 23.67,19.57 v23.67,18.95
  Bottom 0.152: PAD35.P$1 0,7.97
  Bottom 0.2: v23.67,18.95 22.45,18.95 21.52,18.95 20.89,18.32 18.92,18.32 15.33,14.73 15.33,13.27 14.26,12.2 1.74,12.2 1.22,11.68 1.22,9.2 0,7.97
PHASE_C_SOURCE_LOW
  Bottom 0.2: S1.IN 22.2,17.9 19.05,17.9 15.68,14.53 15.68,14.38 15.68,13.02 14.46,11.8 2,11.8 1.57,11.38 1.57,7.52 PAD36.P$1
RGB_LED_BLUE
  Top 0.15: PAD10.P$1 24.9,15.92 24.23,15.25 24.23,13.77 23.67,13.22 23.67,12.05 22.45,10.82 20.42,10.82 19.85,10.25 R5.2
RGB_LED_GREEN
  Top 0.15: PAD11.P$1 23.98,13.02 23.98,11.93 22.57,10.52 20.55,10.52 20.17,10.15 20.17,9.15 20.85,8.47 R6.2
RGB_LED_RED
  Top 0.15: R7.2 22.35,10.22 22.7,10.22 24.42,11.95 PAD12.P$1
TEMPERATURE_SENSOR  (via drill 0.3 pad 0.6)
  Top 0.15: C4.1 v2.47,5.05
  Top 0.2: IC1.3 2.22,30.67 v1.95,30.67
  gnd 0.15: v2.47,5.05 0.77,6.75 0.77,12.24 0.65,12.36 0.65,17.57 6.05,22.97 6.05,27.32 5.62,27.75 3.35,27.75 1.95,29.15 v1.95,30.67
  Bottom 0.15: PAD41.P$1 6.7,0.75 1.27,0.75 0.77,1.25 0.77,4.17 1.65,5.05 v2.47,5.05
VDC  (via drill 0.3 pad 0.6)
  Top 0.15: Q3.EP-7-8 v20.85,24.75
  Top 0.152: Q2.EP-7-8 v11.65,24.75 | Q1.EP-7-8 v2.45,24.75
  Bottom 0.7: PAD24.P$1 3.45,31.05 4.15,31.75 C1.+
  other vias: 8.15,27.1 7.55,27.1 8.75,27.12 8.15,22.6 7.55,22.6 6.95,22.6 17.35,27.1 16.75,27.1 17.95,27.12 16.15,27.1 17.35,22.6 16.75,22.6 16.15,22.6 1.52,24.75 1.52,25.75 2.45,25.75 2.45,23.75 1.52,26.75 2.45,26.75 10.65,24.75 10.65,25.75 11.65,25.75 11.65,23.75 10.65,23.75 10.65,26.75 11.65,26.75 19.85,24.75 19.85,25.75 20.85,25.75 20.85,23.75 19.85,23.75 19.85,26.75 20.85,26.75 1.95,16.35 1.25,16.35 2.65,16.35 2.65,14.75 2.65,15.55 1.95,14.75 1.95,15.55 1.32,14.75 1.27,15.55 1.52,23.75 18.51,12.77 18.51,12.17 18.51,11.57
  pour pwr (rank 3): 0,33.6 0,0 24.9,0 24.9,33.6
  pour Top (no thermals): 6.7,28.35 6.7,26.9 9,26.9 9,28.35
  pour Top (no thermals): 6.7,23.85 6.7,22.4 9,22.4 9,23.85
  pour Top (no thermals): 15.9,28.35 15.9,26.9 18.2,26.9 18.2,28.35
  pour Top (no thermals): 15.9,23.85 15.9,22.4 18.2,22.4 18.2,23.85
  pour Top (no thermals): 16.57,13.07 18.82,13.07 18.82,11.12 16.57,11.12
  pour Bottom: 3.3,22.88 1.22,22.88 1.22,28.27 3.3,28.27
  pour Bottom: 12.05,21.12 9.5,21.12 9.5,30 12.05,30
  pour Bottom: 21.52,19.57 18.98,19.57 18.98,28.8 21.52,28.8
  pour gnd (rank 2): 0.75,26.95 0.75,23.52 2.65,23.52 2.65,26.95
  pour gnd (rank 2): 10.42,26.95 10.42,23.52 11.85,23.52 11.85,26.95
  pour gnd (rank 2): 19.65,26.98 19.65,23.55 21.05,23.55 21.05,26.98
VDD_5V  (via drill 0.3 pad 0.6)
  Top 0.15: LED4.+ 22.17,3 v22.02,3.15
  Top 0.2: C5.1 1.65,32.92 v1.05,32.33 1.05,30.67 IC1.4 | v2.5,8.07 2.82,8.07 2.92,7.97 2.92,7.4 3.12,7.2 3.12,1.62 2.9,1.4 2.7,1.4 LED2.A
  Top 0.3: IC3.3 2.65,9.21 2.5,9.36 C10.1
  Top 0.5: IC2.3 C11.1 12.62,8.35 12.22,7.94 v11.27,7.94 IC3.5
  gnd 0.5: v6.9,18.8 v6.3,18.8 6.3,18.47 3.42,15.6 3.42,14.38 1.7,12.65 1.7,9.9 2.5,9.1 v2.5,8.65
  Bottom 0.2: v22.02,3.15 21.67,3.5 21.67,5.7 22.05,6.07 22.05,6.65 20.75,7.94 12.47,7.94 | v11.88,7.94 12.47,7.94 | PAD22.P$1 7.05,30.3 7.05,31.22 6.8,31.47 6.8,32.1 6.2,32.7 1.42,32.7 v1.05,32.33 | LED1.A 11.67,2.05 12.4,2.05 12.52,2.17 LED3.+ 12.52,7.89 12.47,7.94
  Bottom 0.5: PAD22.P$1 7.45,29.65 6.02,28.23 6.02,20.77 6.9,19.9 v6.9,18.8 | v2.5,8.65 v2.5,8.07 2.63,7.94 v11.27,7.94 v11.88,7.94
  pour Top (no thermals): 2.3,9.55 2.92,9.55 2.92,7.82 2.3,7.82
  pour Bottom (no thermals): 6.07,19.07 6.07,18.45 7.05,18.45 7.05,19.07
  pour gnd (no thermals): 2.3,9.12 2.7,9.12 2.7,7.87 2.3,7.87

### Text on the board
Top: BLOXA 1.0
tPlace: + | + | C1 | + | C3 | C2